# EAGLE design Menorah (EAGLE 7.1.0)
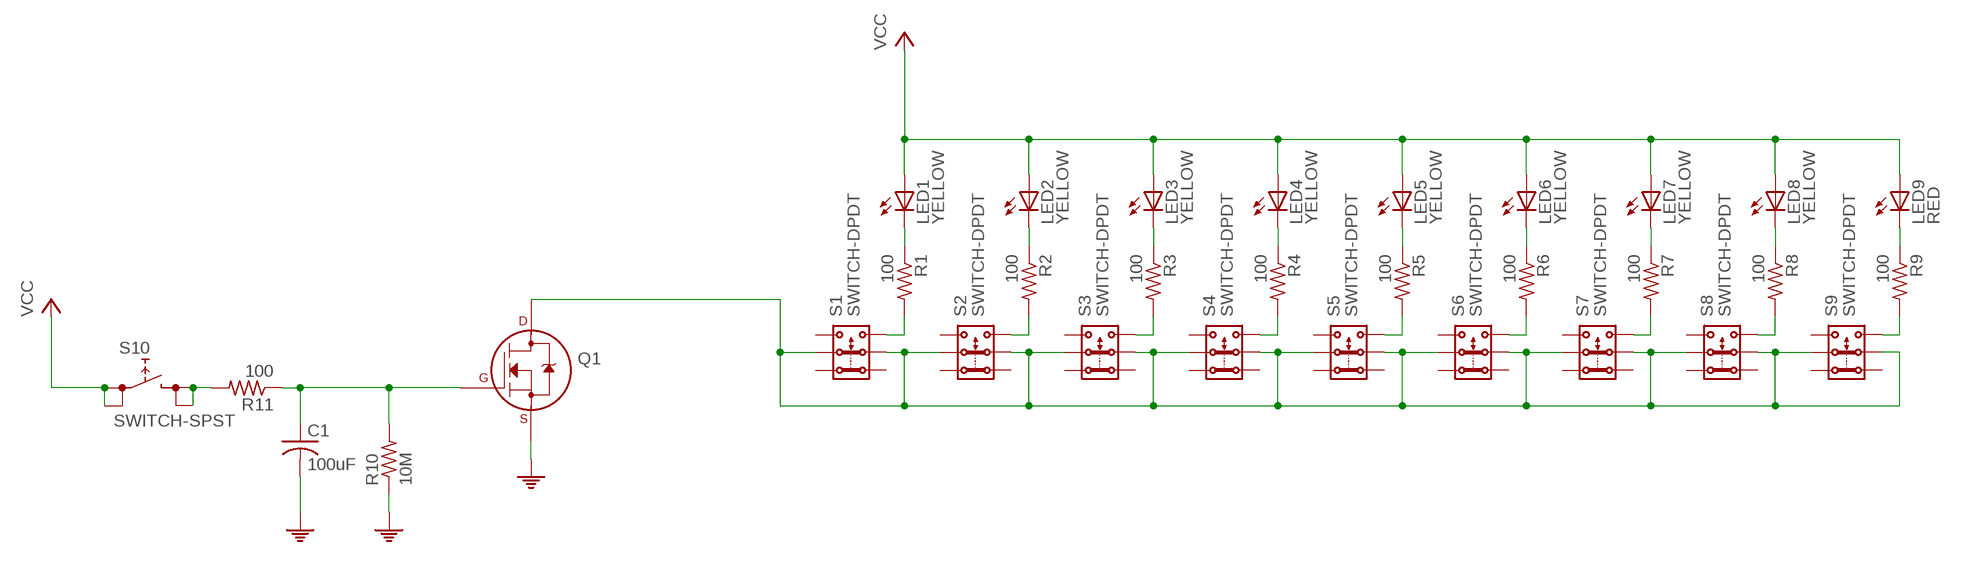
[diagram p0: schematic, sheet 1]

## Parts
C1  100uF  C-USC1206  [C1206]
LED1  YELLOW  LEDCHIPLED_0805  [CHIPLED_0805]
LED2  YELLOW  LEDCHIPLED_0805  [CHIPLED_0805]
LED3  YELLOW  LEDCHIPLED_0805  [CHIPLED_0805]
LED4  YELLOW  LEDCHIPLED_0805  [CHIPLED_0805]
LED5  YELLOW  LEDCHIPLED_0805  [CHIPLED_0805]
LED6  YELLOW  LEDCHIPLED_0805  [CHIPLED_0805]
LED7  YELLOW  LEDCHIPLED_0805  [CHIPLED_0805]
LED8  YELLOW  LEDCHIPLED_0805  [CHIPLED_0805]
LED9  RED  LEDCHIPLED_0805  [CHIPLED_0805]
Q1  2N7002A_SOT23  [SOT-23]
R1  100  R-US_R0805  [R0805]
R2  100  R-US_R0805  [R0805]
R3  100  R-US_R0805  [R0805]
R4  100  R-US_R0805  [R0805]
R5  100  R-US_R0805  [R0805]
R6  100  R-US_R0805  [R0805]
R7  100  R-US_R0805  [R0805]
R8  100  R-US_R0805  [R0805]
R9  100  R-US_R0805  [R0805]
R10  10M  R-US_R0805  [R0805]
R11  100  R-US_R0805  [R0805]
S1  SWITCH-DPDT  [JS202011SCQN]
S2  SWITCH-DPDT  [JS202011SCQN]
S3  SWITCH-DPDT  [JS202011SCQN]
S4  SWITCH-DPDT  [JS202011SCQN]
S5  SWITCH-DPDT  [JS202011SCQN]
S6  SWITCH-DPDT  [JS202011SCQN]
S7  SWITCH-DPDT  [JS202011SCQN]
S8  SWITCH-DPDT  [JS202011SCQN]
S9  SWITCH-DPDT  [JS202011SCQN]
S10  SWITCH-SPST  [KS-01Q-01]

## Nets
N$1: LED1.C R1.1
N$2: LED2.C R2.1
N$3: LED3.C R3.1
N$4: LED4.C R4.1
N$5: LED5.C R5.1
N$6: LED6.C R6.1
N$7: LED7.C R7.1
N$8: LED8.C R8.1
N$9: LED9.C R9.1
N$10: R1.2 S1.3
N$11: R2.2 S2.3
N$12: R3.2 S3.3
N$13: R4.2 S4.3
N$14: R5.2 S5.3
N$15: R6.2 S6.3
N$16: R7.2 S7.3
N$17: R8.2 S8.3
N$18: R9.2 S9.3
N$19: R11.2 S10.2 S10.4
N$21: Q1.3(D) S1.2 S1.5 S2.2 S2.5 S3.2 S3.5 S4.2 S4.5 S5.2 S5.5 S6.2 S6.5 S7.2 S7.5 S8.2 S8.5 S9.2 S9.5
N$22: C1.1 Q1.1(G) R10.2 R11.1
PE: C1.2 Q1.2(S) R10.1
VCC: LED1.A LED2.A LED3.A LED4.A LED5.A LED6.A LED7.A LED8.A LED9.A S10.1 S10.3
Unconnected: S1.1 S1.4 S1.6 S2.1 S2.4 S2.6 S3.1 S3.4 S3.6 S4.1 S4.4 S4.6 S5.1 S5.4 S5.6 S6.1 S6.4 S6.6 S7.1 S7.4 S7.6 S8.1 S8.4 S8.6 S9.1 S9.4 S9.6

## Library data of the parts
C1 = rcl:C-US: CAPACITOR, American symbol; DIGIKEY: 490-4539-1-ND
LED1-LED8 = led:LED: LED OSRAM: - CHIPLED LG R971, LG N971, LY N971, LG Q971, LY Q971, LO R971, LY R971 LH N974, LH R974 LS Q976, LO Q976, LY Q976 LO Q996 - Hyper CHIPLED LW Q18S LB Q993, LB Q99A, LB R99A - SideLED LS A670, LO A670, LY A670, LG A670, LP A670 LB A673, LV A673, LT A673, LW A673 LH A674 LY A675 LS A676, LA A676, LO A676, LY A676, LW A676 LS A679, LY A679, LG A679 - Hyper Micro SIDELED® LS Y876, LA Y876, LO Y876, LY Y876 LT Y87S - SmartLED LW L88C, LW L88S LB L89C, LB L89S, LG L890 LS L89K, LO L89K, LY L89K LS L896, LA L896, LO L896, LY L896 - TOPLED LS T670, LO T670, LY T670, LG T670, LP T670 LSG T670, LSP T670, LSY T670, LOP T670, LYG T670 LG T671, LOG T671, LSG T671 LB T673, LV T673, LT T673, LW T673 LH T674 LS T676, LA T676, LO T676, LY T676, LB T676, LH T676, LSB T676, LW T676 LB T67C, LV T67C, LT T67C, LS T67K, LO T67K, LY T67K, LW E67C LS E67B, LA E67B, LO E67B, LY E67B, LB E67C, LV E67C, LT E67C LW T67C LS T679, LY T679, LG T679 LS T770, LO T770, LY T770, LG T770, LP T770 LB T773, LV T773, LT T773, LW T773 LH T774 LS E675, LA E675, LY E675, LS T675 LS T776, LA T776, LO T776, LY T776, LB T776 LHGB T686 LT T68C, LB T68C - Hyper Mini TOPLED® LB M676 - Mini TOPLED Santana® LG M470 LS M47K, LO M47K, LY M47K Source: http://www.osram.convergy.de LUXEON: - LUMILED® LXK2-PW12-R00, LXK2-PW12-S00, LXK2-PW14-U00, LXK2-PW14-V00 LXK2-PM12-R00, LXK2-PM12-S00, LXK2-PM14-U00 LXK2-PE12-Q00, LXK2-PE12-R00, LXK2-PE12-S00, LXK2-PE14-T00, LXK2-PE14-U00 LXK2-PB12-K00, LXK2-PB12-L00, LXK2-PB12-M00, LXK2-PB14-N00, LXK2-PB14-P00, LXK2-PB14-Q00 LXK2-PR12-L00, LXK2-PR12-M00, LXK2-PR14-Q00, LXK2-PR14-R00 LXK2-PD12-Q00, LXK2-PD12-R00, LXK2-PD12-S00 LXK2-PH12-R00, LXK2-PH12-S00 LXK2-PL12-P00, LXK2-PL12-Q00, LXK2-PL12-R00 Source: www.luxeon.com KINGBRIGHT: KA-3528ASYC Source: www.kingbright.com; DIGIKEY: 475-2560-1-ND
LED9 = led:LED: LED OSRAM: - CHIPLED LG R971, LG N971, LY N971, LG Q971, LY Q971, LO R971, LY R971 LH N974, LH R974 LS Q976, LO Q976, LY Q976 LO Q996 - Hyper CHIPLED LW Q18S LB Q993, LB Q99A, LB R99A - SideLED LS A670, LO A670, LY A670, LG A670, LP A670 LB A673, LV A673, LT A673, LW A673 LH A674 LY A675 LS A676, LA A676, LO A676, LY A676, LW A676 LS A679, LY A679, LG A679 - Hyper Micro SIDELED® LS Y876, LA Y876, LO Y876, LY Y876 LT Y87S - SmartLED LW L88C, LW L88S LB L89C, LB L89S, LG L890 LS L89K, LO L89K, LY L89K LS L896, LA L896, LO L896, LY L896 - TOPLED LS T670, LO T670, LY T670, LG T670, LP T670 LSG T670, LSP T670, LSY T670, LOP T670, LYG T670 LG T671, LOG T671, LSG T671 LB T673, LV T673, LT T673, LW T673 LH T674 LS T676, LA T676, LO T676, LY T676, LB T676, LH T676, LSB T676, LW T676 LB T67C, LV T67C, LT T67C, LS T67K, LO T67K, LY T67K, LW E67C LS E67B, LA E67B, LO E67B, LY E67B, LB E67C, LV E67C, LT E67C LW T67C LS T679, LY T679, LG T679 LS T770, LO T770, LY T770, LG T770, LP T770 LB T773, LV T773, LT T773, LW T773 LH T774 LS E675, LA E675, LY E675, LS T675 LS T776, LA T776, LO T776, LY T776, LB T776 LHGB T686 LT T68C, LB T68C - Hyper Mini TOPLED® LB M676 - Mini TOPLED Santana® LG M470 LS M47K, LO M47K, LY M47K Source: http://www.osram.convergy.de LUXEON: - LUMILED® LXK2-PW12-R00, LXK2-PW12-S00, LXK2-PW14-U00, LXK2-PW14-V00 LXK2-PM12-R00, LXK2-PM12-S00, LXK2-PM14-U00 LXK2-PE12-Q00, LXK2-PE12-R00, LXK2-PE12-S00, LXK2-PE14-T00, LXK2-PE14-U00 LXK2-PB12-K00, LXK2-PB12-L00, LXK2-PB12-M00, LXK2-PB14-N00, LXK2-PB14-P00, LXK2-PB14-Q00 LXK2-PR12-L00, LXK2-PR12-M00, LXK2-PR14-Q00, LXK2-PR14-R00 LXK2-PD12-Q00, LXK2-PD12-R00, LXK2-PD12-S00 LXK2-PH12-R00, LXK2-PH12-S00 LXK2-PL12-P00, LXK2-PL12-Q00, LXK2-PL12-R00 Source: www.luxeon.com KINGBRIGHT: KA-3528ASYC Source: www.kingbright.com; DIGIKEY: 475-1415-1-ND
Q1 = transistors:2N700*: 2N7000, 2N7002, NDS7002A N-channel enhancement mode MOSFET
R1-R9 R11 = rcl:R-US_: RESISTOR, American symbol; DIGIKEY: 1276-5508-1-ND
R10 = rcl:R-US_: RESISTOR, American symbol; DIGIKEY: 1276-5617-1-ND
S1-S9 = Menorah:SWITCH-DPDT; DIGIKEY: 401-2002-1-ND
S10 = Menorah:SWITCH-SPST; DIGIKEY: EG4791-ND

## Board
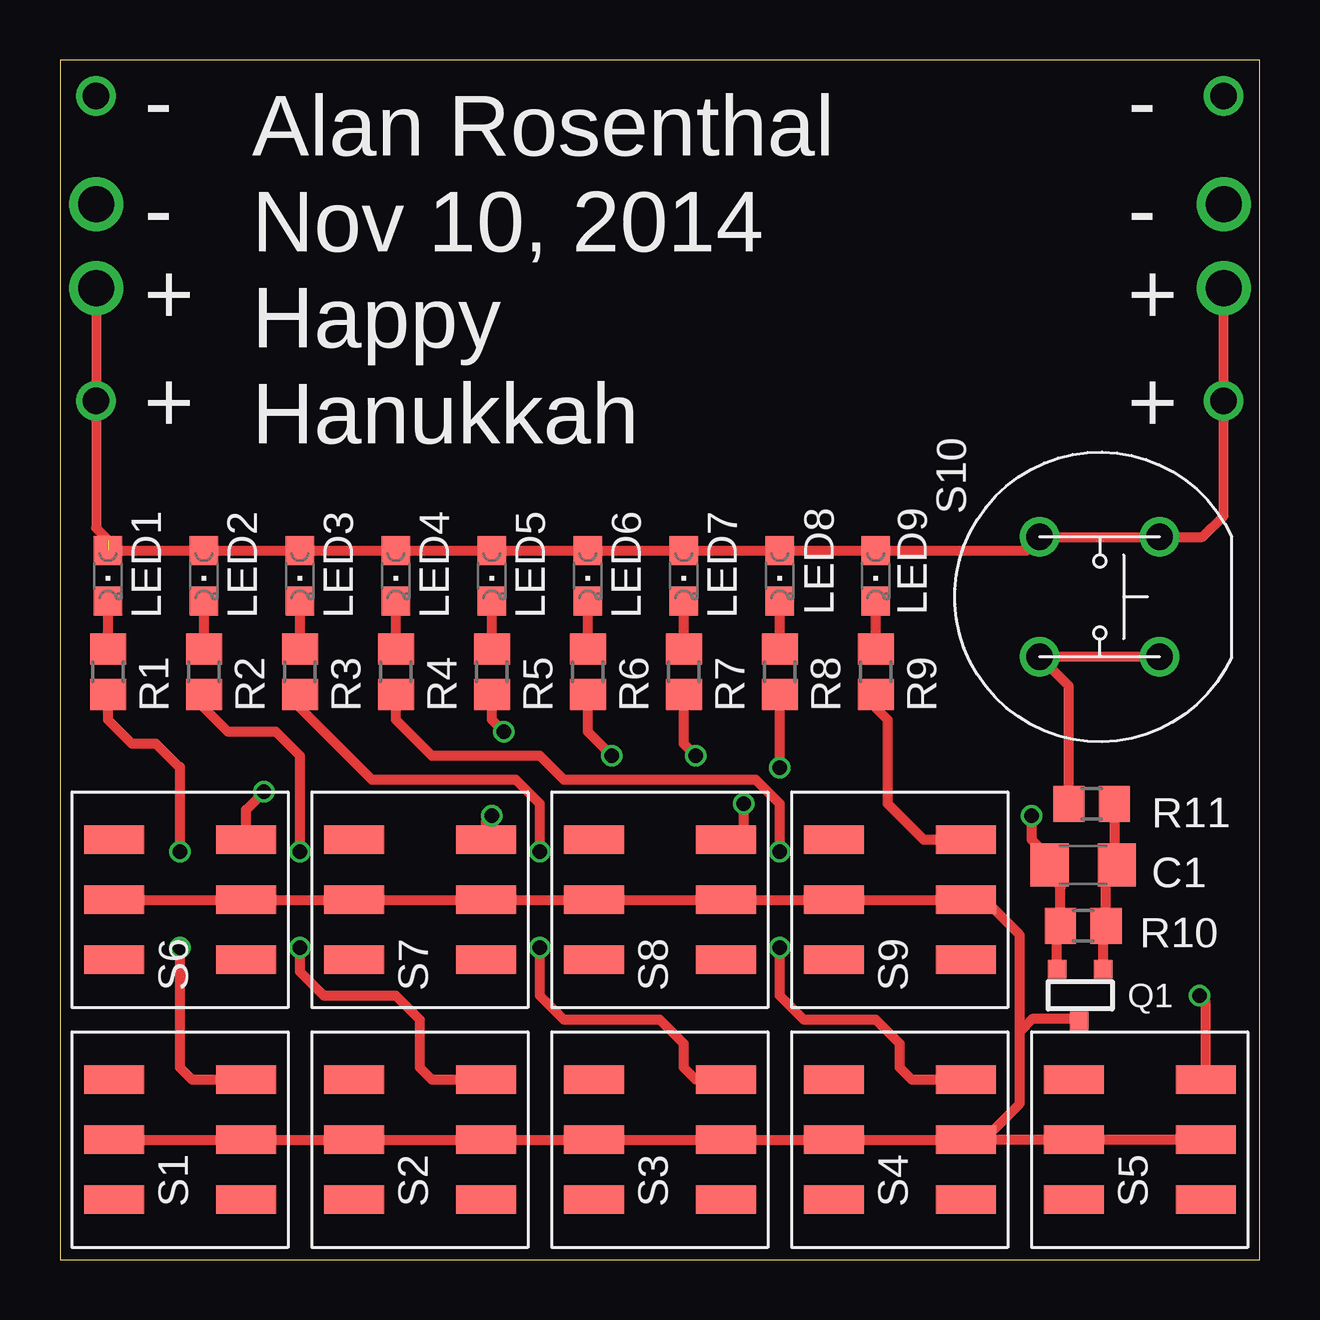
[diagram p1: board, top side]
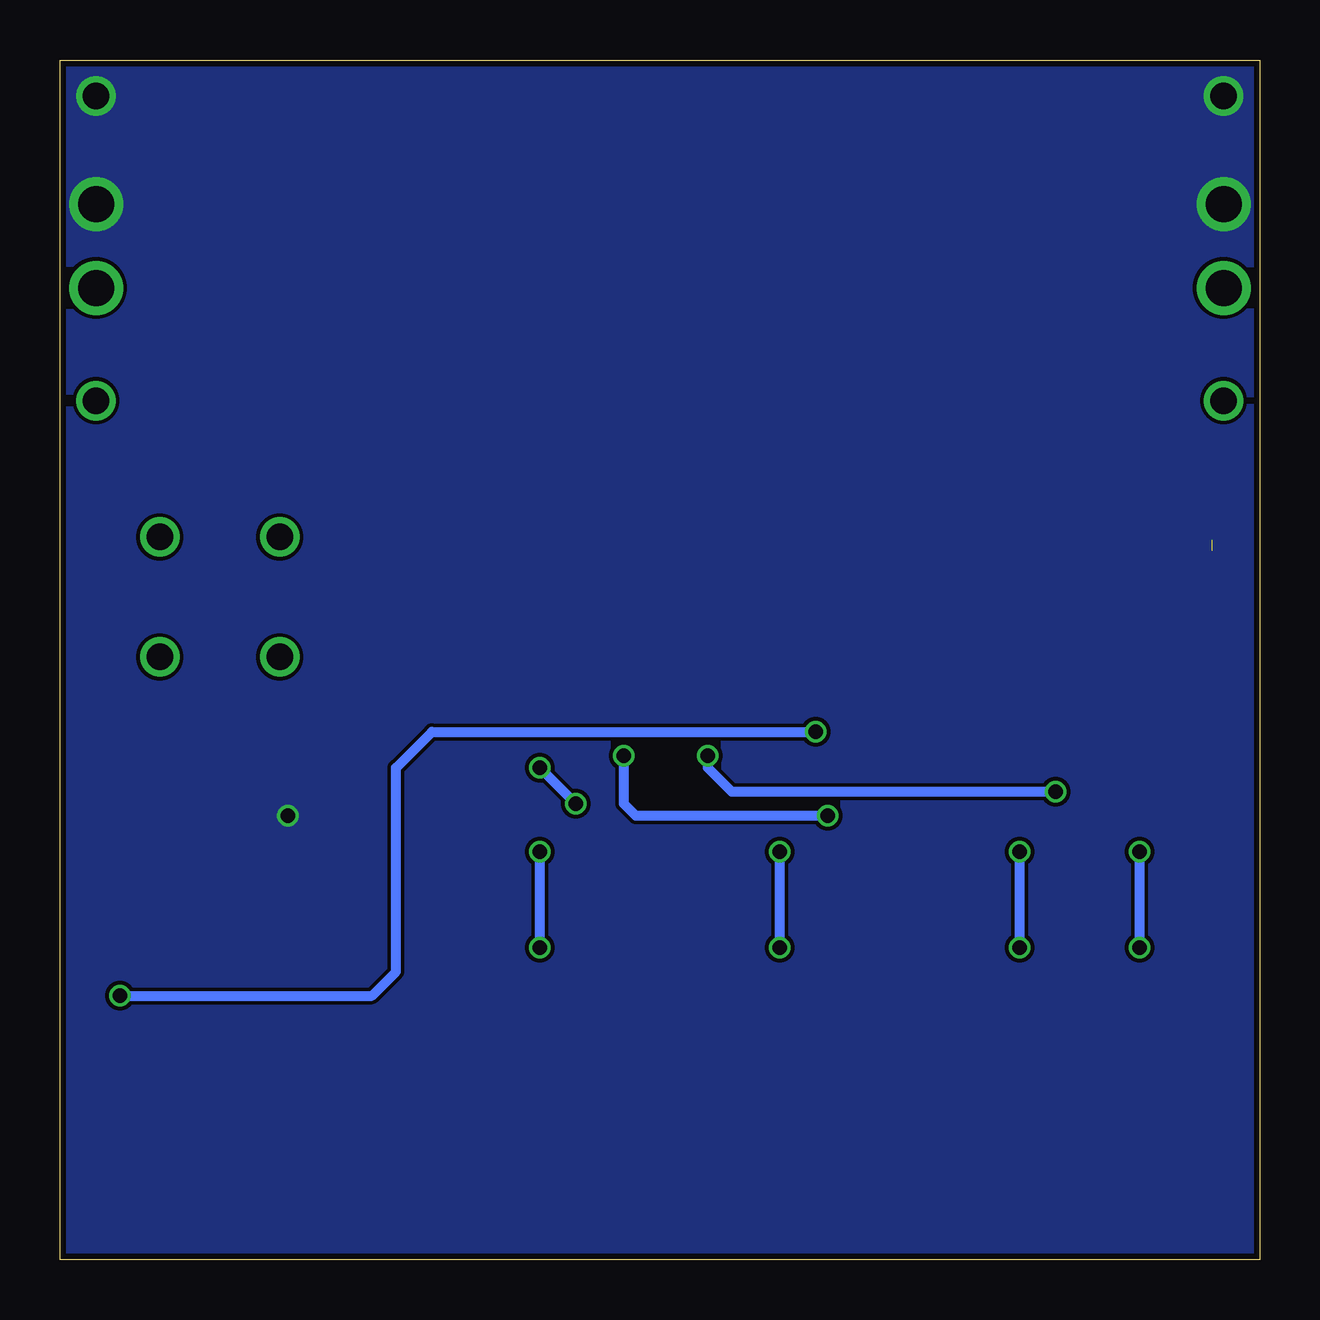
[diagram p2: board, bottom side, seen from below]

Size 50 x 50 mm. Coordinates in mm from the lower left corner, seen from the top.
Outline: 0,0 50,0 50,50 0,50 0,0
Copper layers (1*16): Top 0.035mm / dielectric 1.5mm / Bottom 0.035mm
Design rules "SeeedStudio_2layer_DRU_no_angle_20140221": minimum track width 6mil, minimum drill 12mil, track to track 6mil, track to pad 6mil, pad to pad 6mil, via to via 6mil, smd to smd 0mil, copper to edge 10mil, drill to drill 10mil, minimum pad ring 10mil, minimum via ring 6mil, stop-mask expansion 2mil, vias tented up to drill 100mil, thermal gap 10mil

### Footprints (pad centres in the part's own frame; a part is rotated, then mirrored left to right if it is on the bottom)
C1206 = smd 1.6 x 1.8: 1 -1.4,0; 2 1.4,0
CHIPLED_0805 = smd 1.2 x 1.2: A 0,-1.05; C 0,1.05
SOT-23 = smd 0.762 x 0.762: 1 -0.979,-1.101; 2 0.94,-1.101; 3 0.025,1.067
R0805 = smd 1.3 x 1.5: 1 -0.95,0; 2 0.95,0
JS202011SCQN = smd 1.2 x 2.5: 1 -2.5,-2.75; 2 0,-2.75; 3 2.5,-2.75; 4 -2.5,2.75; 5 0,2.75; 6 2.5,2.75
KS-01Q-01 = drill 1.1: 1 -2.5,2.5; 2 2.5,2.5; 3 -2.5,-2.5; 4 2.5,-2.5

### Placement (x,y rotation side)
C1  42.65,16.45 180 top
LED1  2,28.5 180 top
LED2  6,28.5 180 top
LED3  10,28.5 180 top
LED4  14,28.5 180 top
LED5  18,28.5 180 top
LED6  22,28.5 180 top
LED7  26,28.5 180 top
LED8  30,28.5 180 top
LED9  34,28.5 180 top
Q1  42.5,11 180 top
R1  2,24.5 270 top
R2  6,24.5 270 top
R3  10,24.5 270 top
R4  14,24.5 270 top
R5  18,24.5 270 top
R6  22,24.5 270 top
R7  26,24.5 270 top
R8  30,24.5 270 top
R9  34,24.5 270 top
R10  42.65,13.91 0 top
R11  43,19 180 top
S1  5,5 90 top
S2  15,5 90 top
S3  25,5 90 top
S4  35,5 90 top
S5  45,5 90 top
S6  5,15 90 top
S7  15,15 90 top
S8  25,15 90 top
S9  35,15 90 top
S10  43.34,27.62 270 top

### Tracks (layer width: path | path; a pad name or v marks a point on that pad's centre or on a via)
N$1
  Top 0.406: R1.1 LED1.C
N$2
  Top 0.406: R2.1 LED2.C
N$3
  Top 0.406: R3.1 LED3.C
N$4
  Top 0.406: R4.1 LED4.C
N$5
  Top 0.406: R5.1 LED5.C
N$6
  Top 0.406: R6.1 LED6.C
N$7
  Top 0.406: R7.1 LED7.C
N$8
  Top 0.406: R8.1 LED8.C 30,27.61
N$9
  Top 0.406: R9.1 LED9.C
N$10  (via drill 0.6)
  Top 0.406: S1.3 5.5,7.5 5,8 v5,13 | v5,17 5,20.55 4.95,20.55 4,21.5 3,21.5 2,22.5 R1.2
  Bottom 0.406: v5,13 v5,17
N$11  (via drill 0.6)
  Top 0.406: S2.3 15.5,7.5 15,8 15,10 14,11 11,11 10,12 v10,13 | R2.2 6,23 7,22 9,22 10,21 v10,17
  Bottom 0.406: v10,13 v10,17
N$12  (via drill 0.6)
  Top 0.406: S3.3 26.5,7.5 26,8 26,9 25,10 21,10 20,11 v20,13 | v20,17 20,19 19,20 13,20 10,23 R3.2
  Bottom 0.406: v20,13 v20,17
N$13  (via drill 0.6)
  Top 0.406: S4.3 35.5,7.5 35,8 35,9 34,10 31,10 30,11 v30,13 | v30,17 30,19 29,20 21,20 20,21 15.5,21 14,22.5 R4.2
  Bottom 0.406: v30,13 v30,17
N$14  (via drill 0.6)
  Top 0.406: 18.05,23.5 R5.2 18,22.5 v18.5,22 | S5.3 47.75,10.75 v47.5,11
  Bottom 0.406: v18.5,22 34.5,22 36,20.5 36,12 37,11 v47.5,11
N$15  (via drill 0.6)
  Top 0.406: S6.3 7.75,18.75 v8.5,19.5 | v23,21 22,22 R6.2
  Bottom 0.406: v8.5,19.5 22,19.5 23,20.5 v23,21
N$16  (via drill 0.6)
  Top 0.406: S7.3 17.75,18.25 v18,18.5 | v26.5,21 26,21.5 R7.2
  Bottom 0.406: v18,18.5 26,18.5 26.5,19 v26.5,21
N$17  (via drill 0.6)
  Top 0.406: v28.5,19 28.5,17.5 S8.3 | v30,20.5 R8.2
  Bottom 0.406: v28.5,19 v30,20.5
N$18
  Top 0.406: S9.3 36,17.5 34.5,19 34.5,22.5 34,23 R9.2
N$19
  Top 0.406: R11.2 42.05,23.91 S10.4 S10.2
N$21
  Top 0.406: S6.5 S6.2 S7.5 S7.2 S8.5 S8.2 S9.5 S9.2 37.77,15.03 38.5,15.03 40,13.53 40,9.5 | S1.5 S1.2 S2.5 S2.2 S3.5 S3.2 S4.5 S4.2 | S4.2 S5.5 S5.2 | S4.2 38.5,5 40,6.5 40,9.5 | Q1.3 42.38,10.03 40.52,10.03 40,9.5
N$22
  Top 0.406: Q1.1 43.48,13.79 R10.2 43.6,16 C1.1 43.95,16.55 R11.1
PE  (via drill 0.6, 1.1, 1.5)
  Top 0.406: Q1.2 41.56,13.77 R10.1 41.7,15.5 C1.2 41.25,16.75 40.5,17.5 v40.5,18.5
  other vias: 48.5,44 48.5,48.5 1.5,44 1.5,48.5
  pour Bottom: 0,0 50,0 50,50 0,50
VCC  (via drill 1.1, 1.5)  (1 unrouted)
  Top 0.406: LED1.A LED2.A LED3.A LED4.A LED5.A LED6.A LED7.A LED8.A LED9.A 40.27,29.55 S10.3 S10.1 47.62,30.12 48.5,31 v48.5,35.8 v48.5,40.5 | v1.5,40.5 v1.5,35.8 1.5,30.5 2,30

### Text on the board
tPlace: - | - | Alan Rosenthal | - | Nov 10, 2014 | - | + | + | Happy | + | Hanukkah | +